# Altium schematic sheet lcd.SchDoc
size 1071 x 817 mm
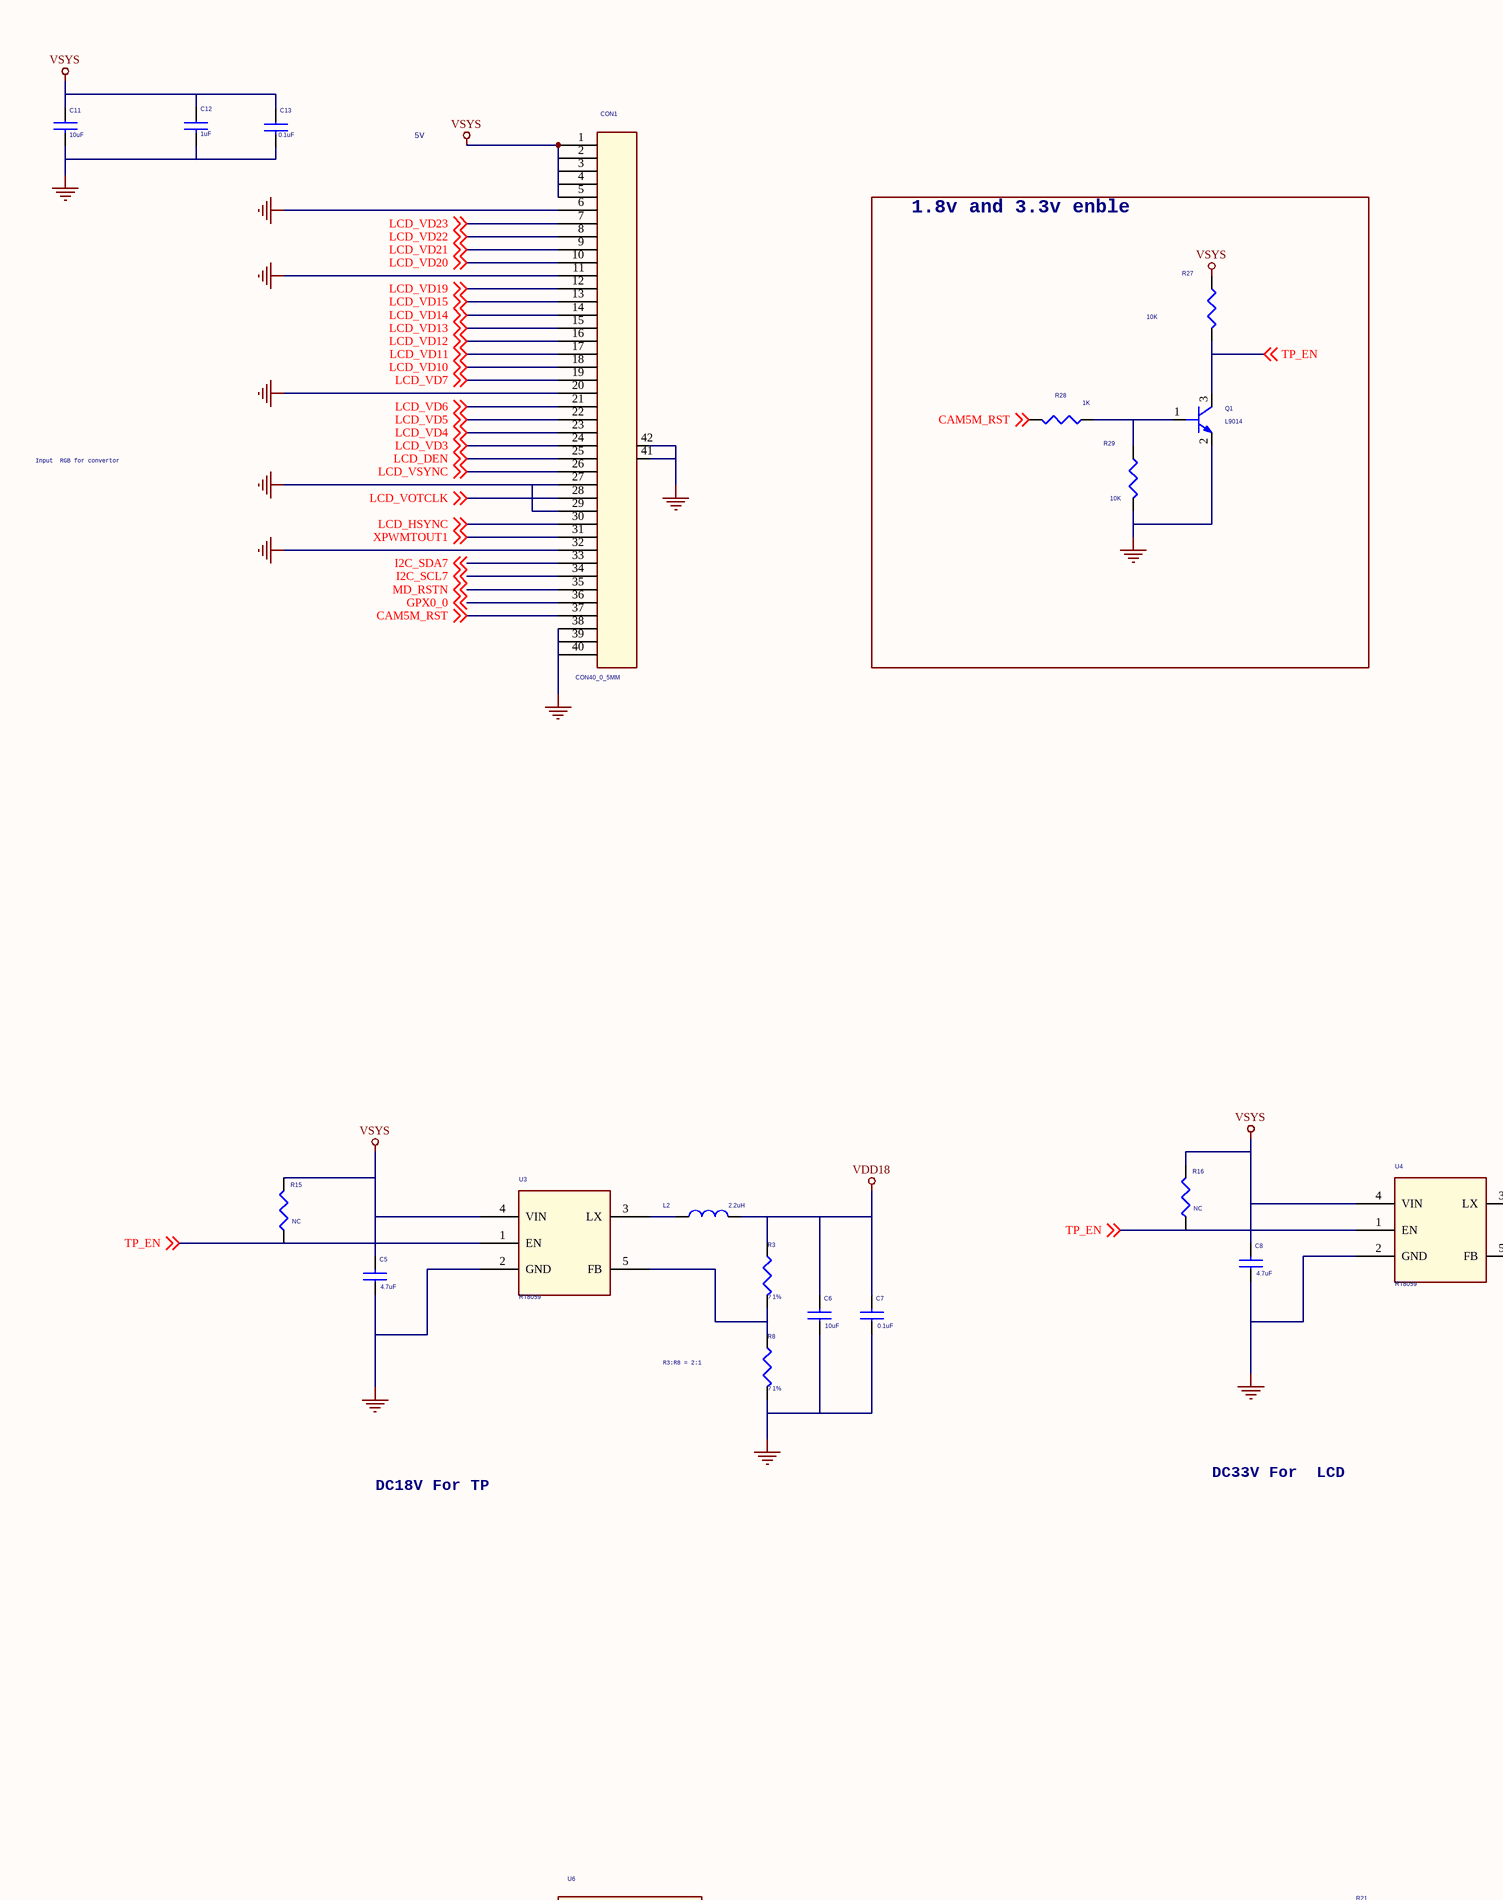
[diagram p0: lcd.SchDoc, top left]
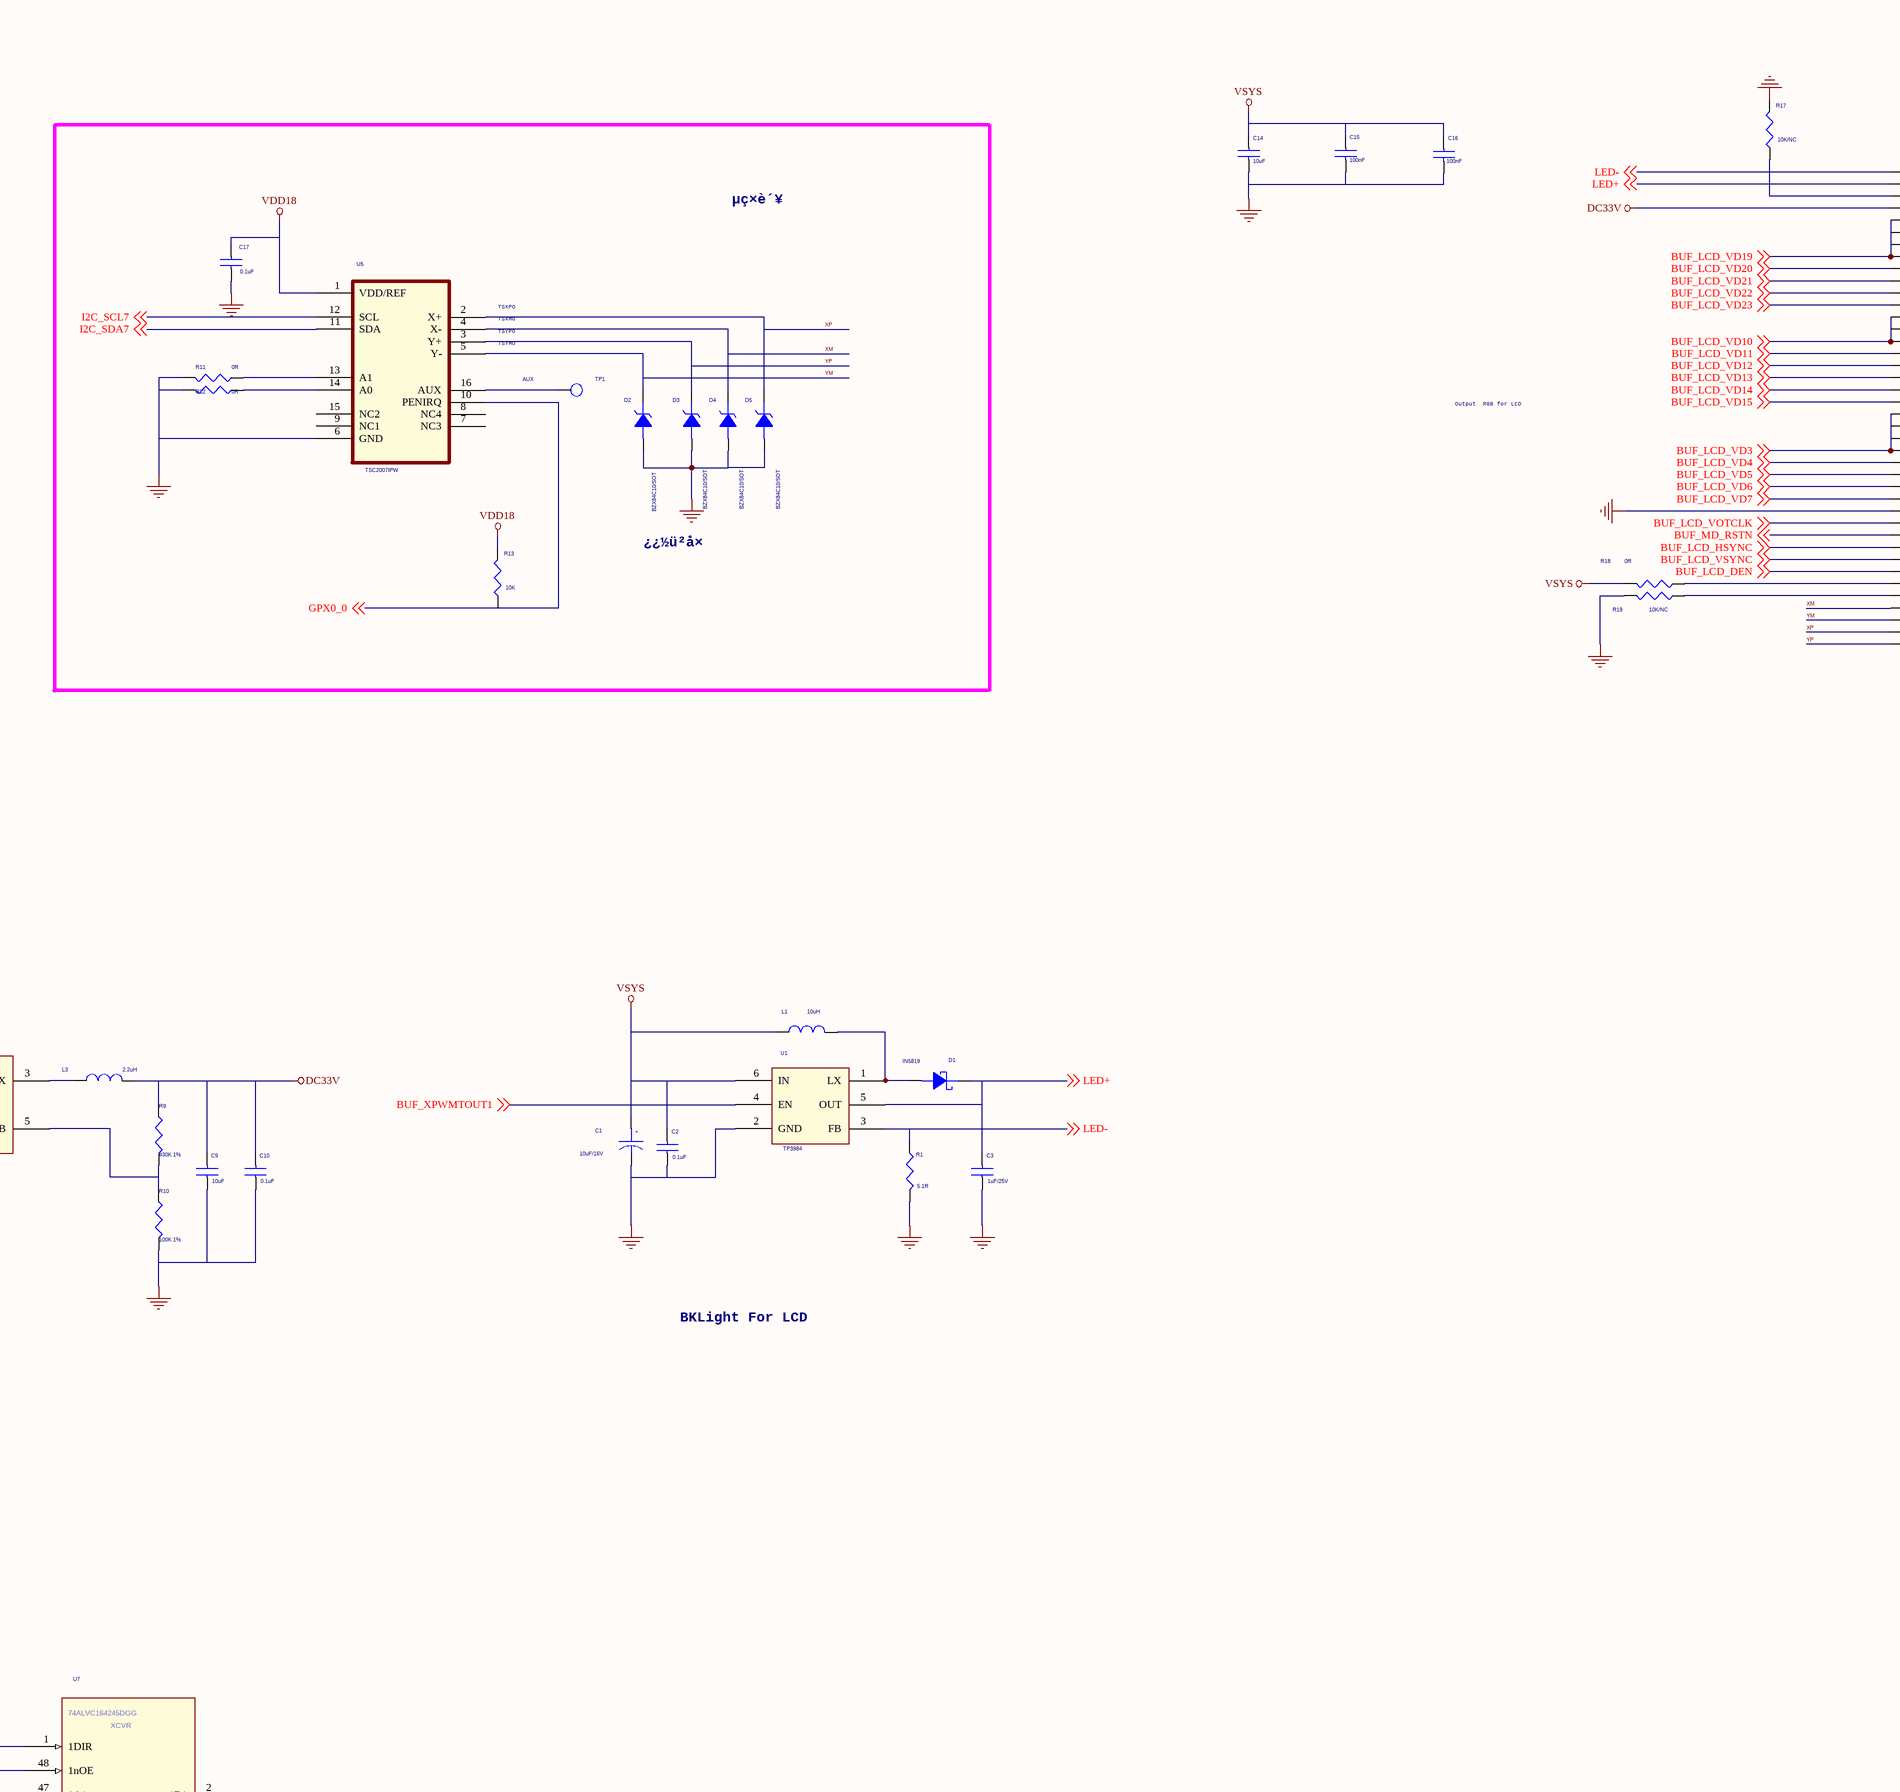
[diagram p1: lcd.SchDoc, top middle]
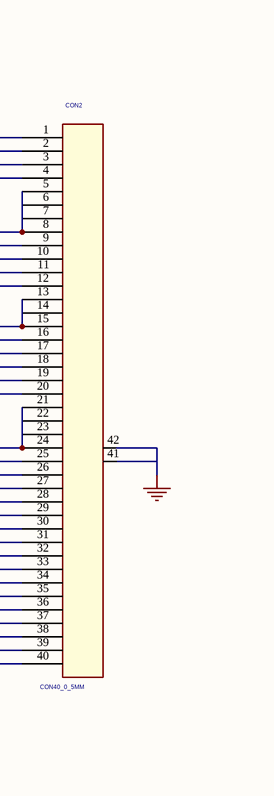
[diagram p2: lcd.SchDoc, top right]
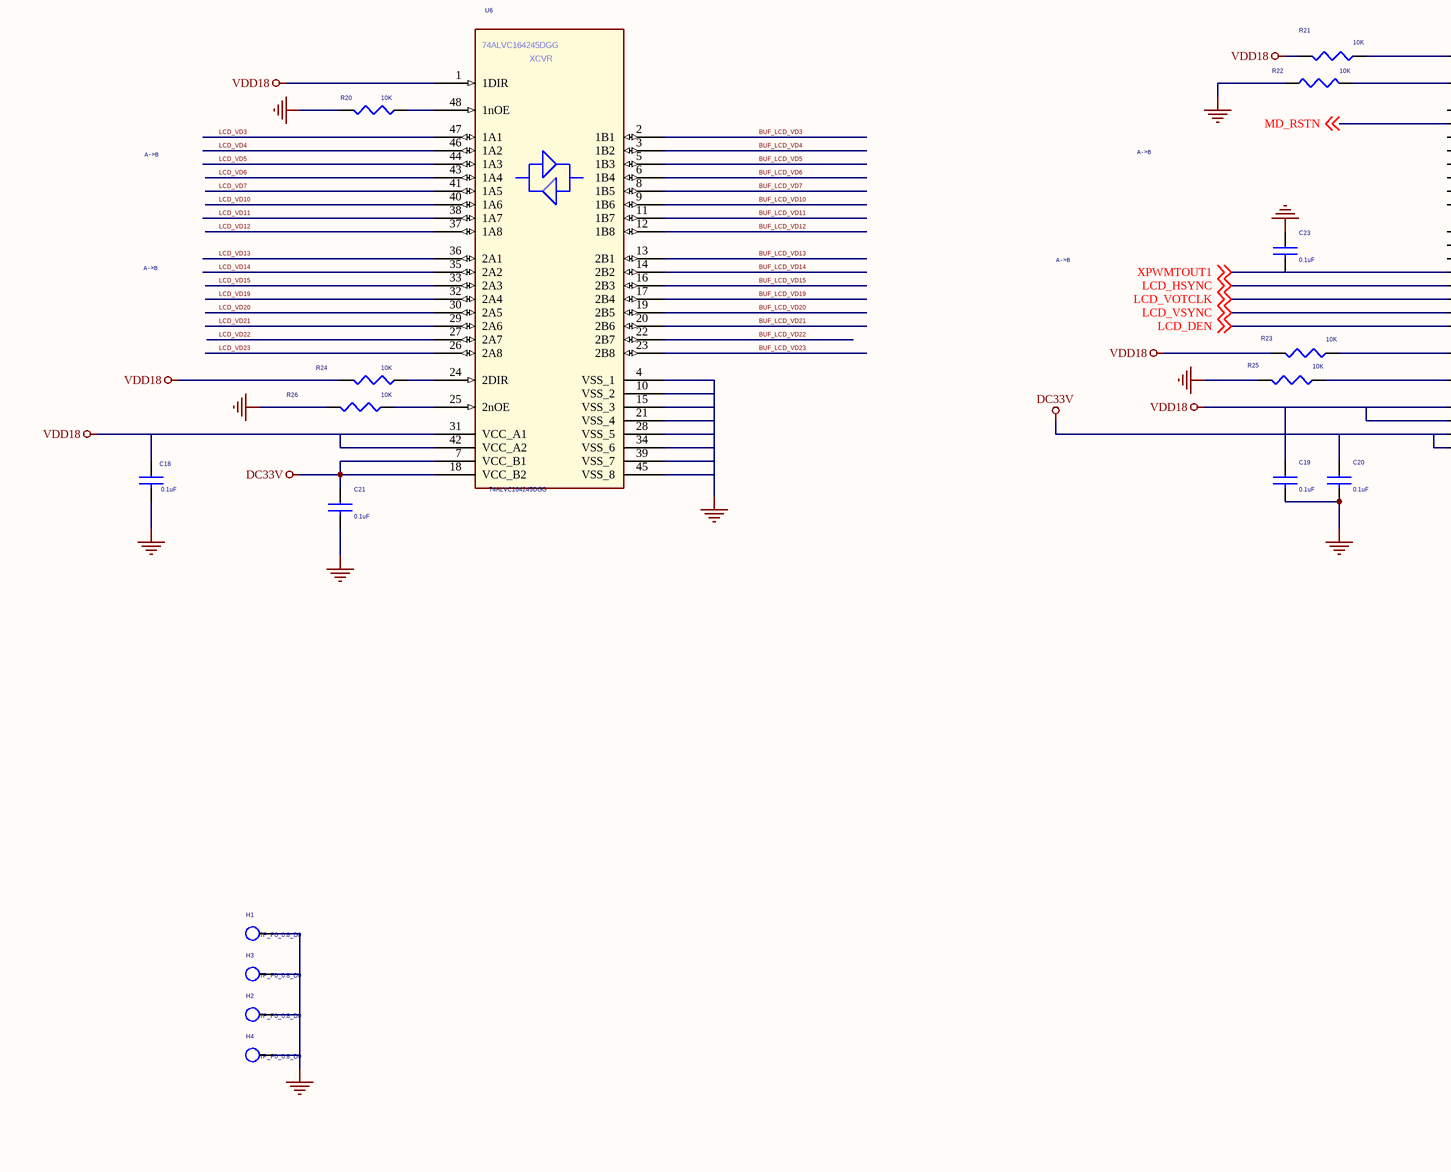
[diagram p3: lcd.SchDoc, bottom left]
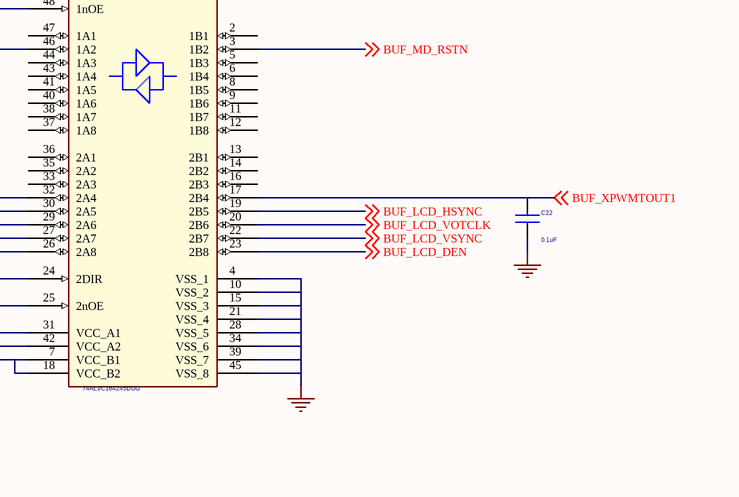
[diagram p4: lcd.SchDoc, bottom middle]
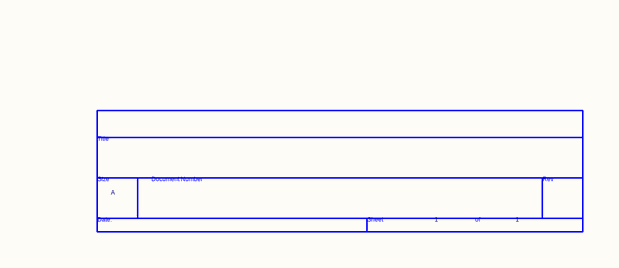
[diagram p5: lcd.SchDoc, bottom right]

## Parts
*  Page Size: A  Page Number: 1  (hidden comment: TitleBlock0)  (graphical)
C1  10uF/16V  [C0603]
C2  0.1uF  [C1005]
C3  1uF/25V  [C1005]
C5  4.7uF  [C1005]
C6  10uF  [C1005]
C7  0.1uF  [C1005]
C8  4.7uF  [C1005]
C9  10uF  [C1005]
C10  0.1uF  [C1005]
C11  10uF  [C1608]
C12  1uF  [C0402]
C13  0.1uF  [C0402]
C14  10uF  [C1608]
C15  100nF  [C0402]
C16  100nF  [C0402]
C17  0.1uF  [C0603]
C18  0.1uF  [C0603]
C19  0.1uF  [C0603]
C20  0.1uF  [C0603]
C21  0.1uF  [C0603]
C22  0.1uF  [C1005]
C23  0.1uF  [C0603]
CON1  CON40_0_5MM  [CON60_0_5MM]
CON2  CON40_0_5MM  [CON60_0_5MM]
D1  IN5819  [D1206]
D2  BZX84C10/SOT  [SOD-523]
D3  BZX84C10/SOT  [SOD-523]
D4  BZX84C10/SOT  [SOD-523]
D5  BZX84C10/SOT  [SOD-523]
H1  TP_P0_0.8_D0  [TP_08]
H2  TP_P0_0.8_D0  [TP_08]
H3  TP_P0_0.8_D0  [TP_08]
H4  TP_P0_0.8_D0  [TP_08]
L1  10uH  [LQH32C]
L2  2.2uH  [LQH32C]
L3  2.2uH  [LQH32C]
Q1  L9014  [SOT-23]
R1  5.1R  [R1005]
R3  ? 1%  [R1005]
R8  ? 1%  [R1005]
R9  430K 1%  [R1005]
R10  100K 1%  [R1005]
R11  0R  [R0603]
R12  0R  [R0603]
R13  10K  [R0603]
R15  NC  [R0603]
R16  NC  [R0603]
R17  10K/NC  [R0603]
R18  0R  [R0603]
R19  10K/NC  [R0603]
R20  10K  [R0603]
R21  10K  [R0603]
R22  10K  [R0603]
R23  10K  [R0603]
R24  10K  [R0603]
R25  10K  [R0603]
R26  10K  [R0603]
R27  10K  [R0402]
R28  1K  [R0402]
R29  10K  [R0402]
TP1  AUX  [TP_08]
U1  TP3984  [SOT23-6L]
U3  RT8059  [TSOT-23-5]
U4  RT8059  [TSOT-23-5]
U5  TSC2007IPW  [TSSOP16]
U6  PART_NUMBER: 74ALVC164245DGG  [TSSOP48]  (hidden comment: U-74ALVC164245DGG)
U7  PART_NUMBER: 74ALVC164245DGG  [TSSOP48]  (hidden comment: U-74ALVC164245DGG)

## Blocks framed on the sheet
1.8v and 3.3v enble: Q1 R27-R29

## Nets
DC33V: C9.2 C10.2 C20.1 C21.1 CON2.4 L3.2 R9.1 U6.7(VCC_B1) U6.18(VCC_B2) U7.7(VCC_B1) U7.18(VCC_B2)
GND: C1.2 C2.1 C3.1 C5.1 C6.1 C7.1 C8.1 C9.1 C10.1 C11.2 C12.2 C13.2 C14.2 C15.2 C16.2 C17.2 C18.2 C19.2 C20.2 C21.2 C22.1 C23.1 CON1.6 CON1.11 CON1.20 CON1.27 CON1.29 CON1.32 CON1.38 CON1.39 CON1.40 CON1.41 CON1.42 CON2.29 CON2.41 CON2.42 D2.1(ANODE) D3.1(ANODE) D4.1(ANODE) D5.1(ANODE) H1.1 H2.1 H3.1 H4.1 Q1.2(EMITTER) R1.2 R8.2 R10.2 R11.2 R12.2 R17.2 R19.2 R20.2 R22.1 R25.2 R26.2 R29.2 U1.2(GND) U3.2(GND) U4.2(GND) U5.6(GND) U6.4(VSS_1) U6.10(VSS_2) U6.15(VSS_3) U6.21(VSS_4) U6.28(VSS_5) U6.34(VSS_6) U6.39(VSS_7) U6.45(VSS_8) U7.4(VSS_1) U7.10(VSS_2) U7.15(VSS_3) U7.21(VSS_4) U7.28(VSS_5) U7.34(VSS_6) U7.39(VSS_7) U7.45(VSS_8)
VDD18: C6.2 C7.2 C17.1 C18.1 C19.1 L2.2 R3.1 R13.2 R21.2 R23.2 R24.2 U5.1(VDD/REF) U6.1(1DIR) U6.31(VCC_A1) U6.42(VCC_A2) U7.31(VCC_A1) U7.42(VCC_A2)
VSYS: C1.1 C2.2 C5.2 C8.2 C11.1 C12.1 C13.1 C14.1 C15.1 C16.1 CON1.1 CON1.2 CON1.3 CON1.4 CON1.5 L1.1 R15.2 R16.2 R18.2 R27.1 U1.6(IN) U3.4(VIN) U4.4(VIN)
BUF_LCD_DEN: CON2.34 U7.23(2B8) ; off-sheet BUF_LCD_DEN
BUF_LCD_HSYNC: CON2.32 U7.19(2B5) ; off-sheet BUF_LCD_HSYNC
BUF_LCD_VD3: CON2.21 CON2.22 CON2.23 CON2.24 U6.2(1B1) ; off-sheet BUF_LCD_VD3
BUF_LCD_VD4: CON2.25 U6.3(1B2) ; off-sheet BUF_LCD_VD4
BUF_LCD_VD5: CON2.26 U6.5(1B3) ; off-sheet BUF_LCD_VD5
BUF_LCD_VD6: CON2.27 U6.6(1B4) ; off-sheet BUF_LCD_VD6
BUF_LCD_VD7: CON2.28 U6.8(1B5) ; off-sheet BUF_LCD_VD7
BUF_LCD_VD10: CON2.13 CON2.14 CON2.15 U6.9(1B6) ; off-sheet BUF_LCD_VD10
BUF_LCD_VD11: CON2.16 U6.11(1B7) ; off-sheet BUF_LCD_VD11
BUF_LCD_VD12: CON2.17 U6.12(1B8) ; off-sheet BUF_LCD_VD12
BUF_LCD_VD13: CON2.18 U6.13(2B1) ; off-sheet BUF_LCD_VD13
BUF_LCD_VD14: CON2.19 U6.14(2B2) ; off-sheet BUF_LCD_VD14
BUF_LCD_VD15: CON2.20 U6.16(2B3) ; off-sheet BUF_LCD_VD15
BUF_LCD_VD19: CON2.5 CON2.6 CON2.7 CON2.8 U6.17(2B4) ; off-sheet BUF_LCD_VD19
BUF_LCD_VD20: CON2.9 U6.19(2B5) ; off-sheet BUF_LCD_VD20
BUF_LCD_VD21: CON2.10 U6.20(2B6) ; off-sheet BUF_LCD_VD21
BUF_LCD_VD22: CON2.11 U6.22(2B7) ; off-sheet BUF_LCD_VD22
BUF_LCD_VD23: CON2.12 U6.23(2B8) ; off-sheet BUF_LCD_VD23
BUF_LCD_VOTCLK: CON2.30 U7.20(2B6) ; off-sheet BUF_LCD_VOTCLK
BUF_LCD_VSYNC: CON2.33 U7.22(2B7) ; off-sheet BUF_LCD_VSYNC
BUF_MD_RSTN: CON2.31 U7.3(1B2) ; off-sheet BUF_MD_RSTN
BUF_XPWMTOUT1: C22.2 U1.4(EN) U7.17(2B4) ; off-sheet BUF_XPWMTOUT1
CAM5M_RST: CON1.37 R28.2 ; off-sheet CAM5M_RST
GPX0_0: CON1.36 R13.1 U5.10(PENIRQ) ; off-sheet GPX0_0
I2C_SCL7: CON1.34 U5.12(SCL) ; off-sheet I2C_SCL7
I2C_SDA7: CON1.33 U5.11(SDA) ; off-sheet I2C_SDA7
LCD_DEN: CON1.25 U7.26(2A8) ; off-sheet LCD_DEN
LCD_HSYNC: CON1.30 U7.30(2A5) ; off-sheet LCD_HSYNC
LCD_VD3: CON1.24 U6.47(1A1) ; off-sheet LCD_VD3
LCD_VD4: CON1.23 U6.46(1A2) ; off-sheet LCD_VD4
LCD_VD5: CON1.22 U6.44(1A3) ; off-sheet LCD_VD5
LCD_VD6: CON1.21 U6.43(1A4) ; off-sheet LCD_VD6
LCD_VD7: CON1.19 U6.41(1A5) ; off-sheet LCD_VD7
LCD_VD10: CON1.18 U6.40(1A6) ; off-sheet LCD_VD10
LCD_VD11: CON1.17 U6.38(1A7) ; off-sheet LCD_VD11
LCD_VD12: CON1.16 U6.37(1A8) ; off-sheet LCD_VD12
LCD_VD13: CON1.15 U6.36(2A1) ; off-sheet LCD_VD13
LCD_VD14: CON1.14 U6.35(2A2) ; off-sheet LCD_VD14
LCD_VD15: CON1.13 U6.33(2A3) ; off-sheet LCD_VD15
LCD_VD19: CON1.12 U6.32(2A4) ; off-sheet LCD_VD19
LCD_VD20: CON1.10 U6.30(2A5) ; off-sheet LCD_VD20
LCD_VD21: CON1.9 U6.29(2A6) ; off-sheet LCD_VD21
LCD_VD22: CON1.8 U6.27(2A7) ; off-sheet LCD_VD22
LCD_VD23: CON1.7 U6.26(2A8) ; off-sheet LCD_VD23
LCD_VOTCLK: CON1.28 U7.29(2A6) ; off-sheet LCD_VOTCLK
LCD_VSYNC: CON1.26 U7.27(2A7) ; off-sheet LCD_VSYNC
LED+: C3.2 CON2.2 D1.2(CATHODE) U1.5(OUT) ; off-sheet LED+
LED-: CON2.1 R1.1 U1.3(FB) ; off-sheet LED-
MD_RSTN: CON1.35 U7.46(1A2) ; off-sheet MD_RSTN
TP_EN: Q1.3(COLLECTOR) R15.1 R16.1 R27.2 U3.1(EN) U4.1(EN) ; off-sheet TP_EN
XM: CON2.37 D4.2(CATHODE) U5.4(X-)
XP: CON2.39 D5.2(CATHODE) U5.2(X+)
XPWMTOUT1: C23.2 CON1.31 U7.32(2A4) ; off-sheet XPWMTOUT1
YM: CON2.38 D2.2(CATHODE) U5.5(Y-)
YP: CON2.40 D3.2(CATHODE) U5.3(Y+)
NetCON2_3: CON2.3 R17.1
NetCON2_35: CON2.35 R18.1
NetCON2_36: CON2.36 R19.1
NetD1_1: D1.1(ANODE) L1.2 U1.1(LX)
NetL2_1: L2.1 U3.3(LX)
NetL3_1: L3.1 U4.3(LX)
NetQ1_1: Q1.1(BASE) R28.1 R29.1
NetR3_2: R3.2 R8.1 U3.5(FB)
NetR9_2: R9.2 R10.1 U4.5(FB)
NetR11_1: R11.1 U5.13(A1)
NetR12_1: R12.1 U5.14(A0)
NetR20_1: R20.1 U6.48(1nOE)
NetR21_1: R21.1 U7.1(1DIR)
NetR22_2: R22.2 U7.48(1nOE)
NetR23_1: R23.1 U7.24(2DIR)
NetR24_1: R24.1 U6.24(2DIR)
NetR25_1: R25.1 U7.25(2nOE)
NetR26_1: R26.1 U6.25(2nOE)
NetTP1_1: TP1.1 U5.16(AUX)

Not connected (* = marked no-connect by the designer): U5 7(NC3) 8(NC4) 9(NC1) 15(NC2); U7 2(1B1) 5(1B3) 6(1B4) 8(1B5) 9(1B6) 11(1B7) 12(1B8) 13(2B1) 14(2B2) 16(2B3) 33(2A3) 35(2A2) 36(2A1) 37(1A8) 38(1A7) 40(1A6) 41(1A5) 43(1A4) 44(1A3) 47(1A1)

## Notes on the sheet
- 5V
- µç×è´¥
- TSXPO
- TSXMO
- TSYPO
- TSYMO
- Input  RGB for convertor
- Output  RGB for LCD
- ¿¿½ü²å×
- R3:R8 = 2:1
- DC18V For TP
- DC33V For  LCD
- BKLight For LCD
- A->B
- (in symbol CAP POL) +
- (in symbol TitleBlock0) Title; Size; Document Number; Rev; Date:; Sheet; of
- (in symbol U-74ALVC164245DGG) XCVR

## Library data of the parts
C1 = CAP POL
C2 C3 C5-C10 C22 = C1005
C11 C14 = C1608
C12 C13 C15 C16 = C0402_0
C17-C21 C23 = C0603_0
CON1 CON2 = CON40_0_1
D1 = DIODE SCHOTTKY
D2-D5 = BZX84C10/SOT_1
L1-L3 = LQH32C_1
Q1 = L14P2/TO_1
R1 R3 R8-R10 = R1005_0
R11-R13 R15-R26 = R0603_0
R27-R29 = R
TP1 = TP_P0_0.8_D0
U5 = U-TSC2007IPW
U6 U7 = U-74ALVC164245DGG: ValueP: IC,16 Bit XCVR,TSSOP48; MFGR: Philips; IPN: A78685-001; DEVICE: 74ALVC164245DGG
* = TitleBlock0: Page Create Date: March  8, 1995; Page Count: 1